# Altium schematic sheet SetResetIC.SchDoc
size 420 x 297 mm; SheetNumber: 9; SheetTotal: 21
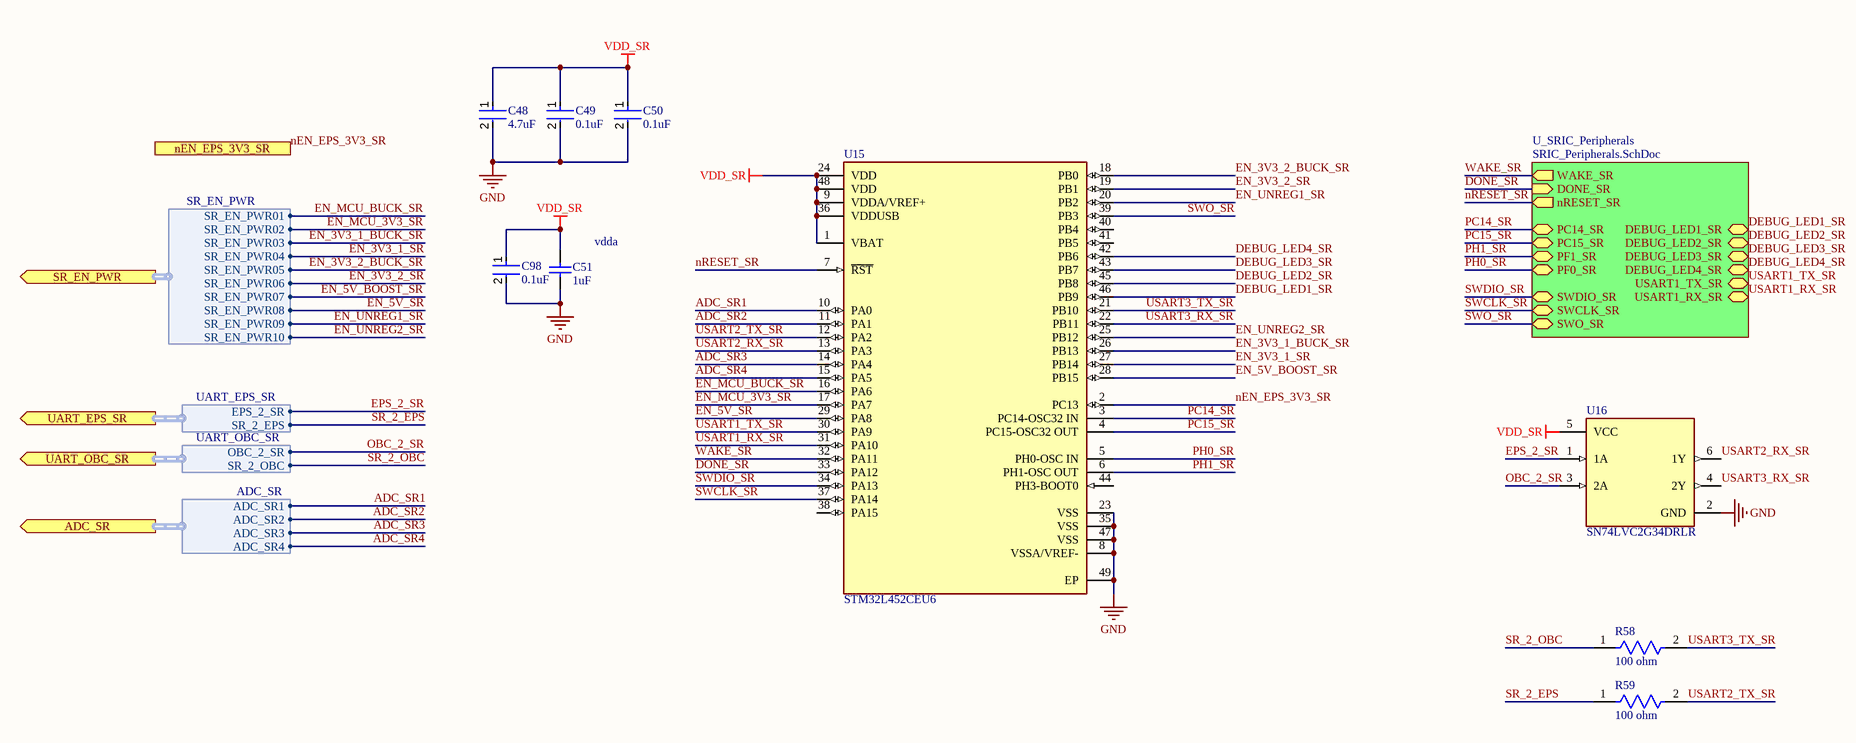
[diagram p0: SetResetIC.SchDoc]

## Parts
C48  4.7uF  [FP-GRM188-0_15-IPC_A]
C49  0.1uF  [FP-C0603C-CF-MFG]
C50  0.1uF  [FP-C0603C-CF-MFG]
C51  1uF  [CAPC1608X90X35ML10T15]
C98  0.1uF  [FP-C0603C-CF-MFG]
R58  100 ohm  [FP-ERJP03-MFG]
R59  100 ohm  [FP-ERJP03-MFG]
U15  STM32L452CEU6  [FP-UFQFPN48-A0B9-MFG]
U16  SN74LVC2G34DRLR  [FP-DRL0006A-MFG]

## Sub-sheets
U_SRIC_Peripherals = SRIC_Peripherals.SchDoc: WAKE_SR (out), nRESET_SR (out), DONE_SR (in), SWDIO_SR (bidir), SWCLK_SR (bidir), SWO_SR (bidir), DEBUG_LED1_SR (bidir), DEBUG_LED2_SR (bidir), DEBUG_LED3_SR (bidir), DEBUG_LED4_SR (bidir), PC14_SR (bidir), PC15_SR (bidir), PF1_SR (bidir), PF0_SR (bidir), USART1_TX_SR (bidir), USART1_RX_SR (bidir)

## Ports
ADC_SR (out, harness ADC_SR), nEN_EPS_3V3_SR (out), SR_EN_PWR (out, harness SR_EN_PWR), UART_EPS_SR (out, harness UART_EPS_SR), UART_OBC_SR (out, harness UART_OBC_SR)

## Harnesses
SR_EN_PWR: SR_EN_PWR01, SR_EN_PWR02, SR_EN_PWR03, SR_EN_PWR04, SR_EN_PWR05, SR_EN_PWR06, SR_EN_PWR07, SR_EN_PWR08, SR_EN_PWR09, SR_EN_PWR10
UART_EPS_SR: EPS_2_SR, SR_2_EPS
UART_OBC_SR: OBC_2_SR, SR_2_OBC
ADC_SR: ADC_SR1, ADC_SR2, ADC_SR3, ADC_SR4

## Nets
GND: C48.2 C49.2 C50.2 C51.1 C98.2 U15.8(VSSA/VREF-) U15.23(VSS) U15.35(VSS) U15.47(VSS) U15.49(EP) U16.2(GND)
VDD_SR: C48.1 C49.1 C50.1 C51.2 C98.1 U15.1(VBAT) U15.9(VDDA/VREF+) U15.24(VDD) U15.36(VDDUSB) U15.48(VDD) U16.5(VCC)
ADC_SR1: U15.10(PA0) ; port ADC_SR.ADC_SR1
ADC_SR2: U15.11(PA1) ; port ADC_SR.ADC_SR2
ADC_SR3: U15.14(PA4) ; port ADC_SR.ADC_SR3
ADC_SR4: U15.15(PA5) ; port ADC_SR.ADC_SR4
DEBUG_LED1_SR: U15.46(PB9) ; sheet U_SRIC_Peripherals/DEBUG_LED1_SR
DEBUG_LED2_SR: U15.45(PB8) ; sheet U_SRIC_Peripherals/DEBUG_LED2_SR
DEBUG_LED3_SR: U15.43(PB7) ; sheet U_SRIC_Peripherals/DEBUG_LED3_SR
DEBUG_LED4_SR: U15.42(PB6) ; sheet U_SRIC_Peripherals/DEBUG_LED4_SR
DONE_SR: U15.33(PA12) ; sheet U_SRIC_Peripherals/DONE_SR
EN_3V3_1_BUCK_SR: U15.26(PB13) ; port SR_EN_PWR.SR_EN_PWR03
EN_3V3_1_SR: U15.27(PB14) ; port SR_EN_PWR.SR_EN_PWR04
EN_3V3_2_BUCK_SR: U15.18(PB0) ; port SR_EN_PWR.SR_EN_PWR05
EN_3V3_2_SR: U15.19(PB1) ; port SR_EN_PWR.SR_EN_PWR06
EN_5V_BOOST_SR: U15.28(PB15) ; port SR_EN_PWR.SR_EN_PWR07
EN_5V_SR: U15.29(PA8) ; port SR_EN_PWR.SR_EN_PWR08
EN_MCU_3V3_SR: U15.17(PA7) ; port SR_EN_PWR.SR_EN_PWR02
EN_MCU_BUCK_SR: U15.16(PA6) ; port SR_EN_PWR.SR_EN_PWR01
EN_UNREG1_SR: U15.20(PB2) ; port SR_EN_PWR.SR_EN_PWR09
EN_UNREG2_SR: U15.25(PB12) ; port SR_EN_PWR.SR_EN_PWR10
EPS_2_SR: U16.1(1A) ; port UART_EPS_SR.EPS_2_SR
nEN_EPS_3V3_SR: U15.2(PC13) ; port nEN_EPS_3V3_SR
nRESET_SR: U15.7(~{RST}) ; sheet U_SRIC_Peripherals/nRESET_SR
OBC_2_SR: U16.3(2A) ; port UART_OBC_SR.OBC_2_SR
PC14_SR: U15.3(PC14-OSC32_IN) ; sheet U_SRIC_Peripherals/PC14_SR
PC15_SR: U15.4(PC15-OSC32_OUT) ; sheet U_SRIC_Peripherals/PC15_SR
PH0_SR: U15.5(PH0-OSC_IN) ; sheet U_SRIC_Peripherals/PF0_SR
PH1_SR: U15.6(PH1-OSC_OUT) ; sheet U_SRIC_Peripherals/PF1_SR
SR_2_EPS: R59.1 ; port UART_EPS_SR.SR_2_EPS
SR_2_OBC: R58.1 ; port UART_OBC_SR.SR_2_OBC
SWCLK_SR: U15.37(PA14) ; sheet U_SRIC_Peripherals/SWCLK_SR
SWDIO_SR: U15.34(PA13) ; sheet U_SRIC_Peripherals/SWDIO_SR
SWO_SR: U15.39(PB3) ; sheet U_SRIC_Peripherals/SWO_SR
USART1_RX_SR: U15.31(PA10) ; sheet U_SRIC_Peripherals/USART1_RX_SR
USART1_TX_SR: U15.30(PA9) ; sheet U_SRIC_Peripherals/USART1_TX_SR
USART2_RX_SR: U15.13(PA3) U16.6(1Y)
USART2_TX_SR: R59.2 U15.12(PA2)
USART3_RX_SR: U15.22(PB11) U16.4(2Y)
USART3_TX_SR: R58.2 U15.21(PB10)
WAKE_SR: U15.32(PA11) ; sheet U_SRIC_Peripherals/WAKE_SR

Not connected (* = marked no-connect by the designer): U15 38(PA15) 40(PB4) 41(PB5) 44(PH3-BOOT0)

## Notes on the sheet
- (near C51) vdda
- THIS DOCUMENT AND THE DATA DISCLOSED HEREIN OR
- HEREWITH IS THE PROPERTY OF ALTIUM LIMITED AND MAY
- DWG NO:
- REVISION
- REV:
- DESCRIPTION
- DATE
- APPROVED
- BE FREELY DISTRIBUTED IN WHOLE. NO RIGHTS ARE
- RESERVED OR EXPRESS OR IMPLIED WARANTEE GIVEN.
- ENG:
- APPROVALS
- PROJECT
- DSN:
- CHK:
- REFERENCE DOCUMENTS
- PROJECT REVISION:
- TITLE
- DOCUMENT REVISION:
- DESIGN ITEM:
- BOM:
- FAB DWG:
- PCB DWG:
- ASSY DWG:
- SCALE:
- A3
- SIZE
- CAGE CODE
- FILE NAME
- DWG NO.
- SHEET
- OF
- REV

## Library data of the parts
C48 = CMP-06035-000034-2: CAP CER 4.7UF 10V X7S 0603; Material: Ceramic; Tolerance: 10%; Height: 0.8mm; Termination: SMD/SMT; Case Code (Metric): 1608; Voltage Rating: 10V; Width: 0.8mm; Resistor Type: Ceramic; Length: 1.6mm; Voltage Rating (DC): 10V; Weight: 0.000222oz; Dielectric: X7S; Package Quantity: 4000; Mount: Surface Mount; Case Code (Imperial): 0603; Case/Package: 0603; Packaging: Tape and Reel; Thickness: 0.037inch; Min Operating Temperature: -55°C; Capacitance: 4.7uF; Max Operating Temperature: 125°C
C49 C50 C98 = CMP-2006-03061-2: CAP CER 0.1UF 50V X7R 0603; Manufacturer: KEMET; Manufacturer Part Number: C0603C104K5RACTU; Tolerance: 0.1; Temperature Coefficient: 30ppm/°C; Material: Ceramic; Automotive Grade: Grade 1; Value: 0.10 μF; Temperature: -55°C to +125°C; RoHS: TRUE; Temperature Range High: +125°C; Lead Free: Yes; Octopart: https://octopart.com/c0603c104k5ractu-kemet-139244; Digikey Description: CAP CER 0.1UF 50V X7R 0603; Category: Cap; Package: C0603C-CF; ComponentLink2Description: Datasheet; Temperature Range Low: -55°C; Device Class L1: Passive Components; Voltage Rating: 50 V; Automotive: Yes; Device Class L3: Ceramic Capacitors; ComponentLink2URL: https://api.kemet.com/component-edge/download/datasheet/C0603C100J5GACAUTO.pdf; Capacitance: 0.10 μF; Device Class L2: Capacitors; Temperature Characteristic: X7R; Height: 0.87mm
C51 = CMP-2006-02534-1: Part Number: GRM188R71C105KA12J; Manufacturer: Murata
R58 R59 = CMP-00287-21317759-1: ERJ-P03F1000V SMD Chip Resistor, 100 Ohm, ± 1%, 200 mW, 0603 [1608 Metric], Thick Film, Anti-Surge; Temperature Coefficient: 200ppm/°C; Resistance: 100Ω; Voltage Rating (DC): 150V; Power Rating: 200mW; Tolerance: 1%; Termination: Tab; RoHS: Compliant; Composition: Thick Film; Min Operating Temperature: -55°C; Contact Plating: Tin; Case Code (Metric): 1608; Case/Package: 0603; Radiation Hardening: No; Mount: Surface Mount; Voltage Rating: 150V; Packaging: Cut Tape; Length: 1.6mm; REACH SVHC: No SVHC; Max Operating Temperature: 155°C; Depth: 800µm; Number of Pins: 2; Lifecycle Status: Production; Schedule B: 8533210045, 8533210045; Military Standard: Not; Height: 550µm; NexarPartId: 21317759; Case Code (Imperial): 0603
U15 = CMP-12105-000040-2: IC MCU 32BIT 512KB FLASH 48QFPN; NexarPartId: 78661784; Number of PWM Channels: 15; Number of USART Channels: 3; Number of A/D Converters: 1; Core Architecture: ARM Cortex-M4; Data Bus Width: 32b; Interface: CAN, I2C, SPI, UART, USART, USB; Number of I2C Channels: 4; Max Supply Voltage: 3.6V; RAM Size: 160kB; Number of Channels: 10; Min Supply Voltage: 1.71V; Max Junction Temperature (Tj): 105°C; Number of I/Os: 38; Frequency: 80MHz; Nominal Supply Current: 30nA; Max Operating Temperature: 85°C; Lifecycle Status: Production; RoHS: Non-Compliant; Ambient Temperature Range High: 85°C; Number of SPI Channels: 3; Number of Timers/Counters: 1; Number of USB Channels: 1; Min Operating Temperature: -40°C; Height: 650µm; Number of D/A Converters: 1; Memory Size: 512kB; Number of ADC Channels: 10; Flash Memory Size: 512kB; Memory Type: FLASH; Number of UART Channels: 1
U16 = CMP-0859-00812-4: IC BUFFER NON-INVERT 5.5V 6SOT; Number of Bits per Element: 1; Number of Bits: 2; Low Level Output Current: 32mA; Polarity: Non-Inverting; Min Supply Voltage: 1.65V; Propagation Delay: 8.6ns; High Level Output Current: -32mA; Quiescent Current: 10uA; Contact Plating: Gold; Case/Package: SOT; Technology: CMOS; Min Operating Temperature: -40°C; Number of Elements: 2; REACH SVHC: No SVHC; Number of Channels: 2; Series: 74LVC; Number of Pins: 6; Mount: Surface Mount; Logic Function: Buffer; Number of Output Lines: 2; Packaging: Tape and Reel; Package Quantity: 4000; Radiation Hardening: No; Number of Gates: 2; Turn-On Delay Time: 8.6ns; Max Operating Temperature: 125°C; Max Supply Voltage: 5.5V; Lead Free: Lead Free; RoHS Compliant: Yes; Number of Outputs: 2; Number of Inputs: 2; Number of Input Lines: 2